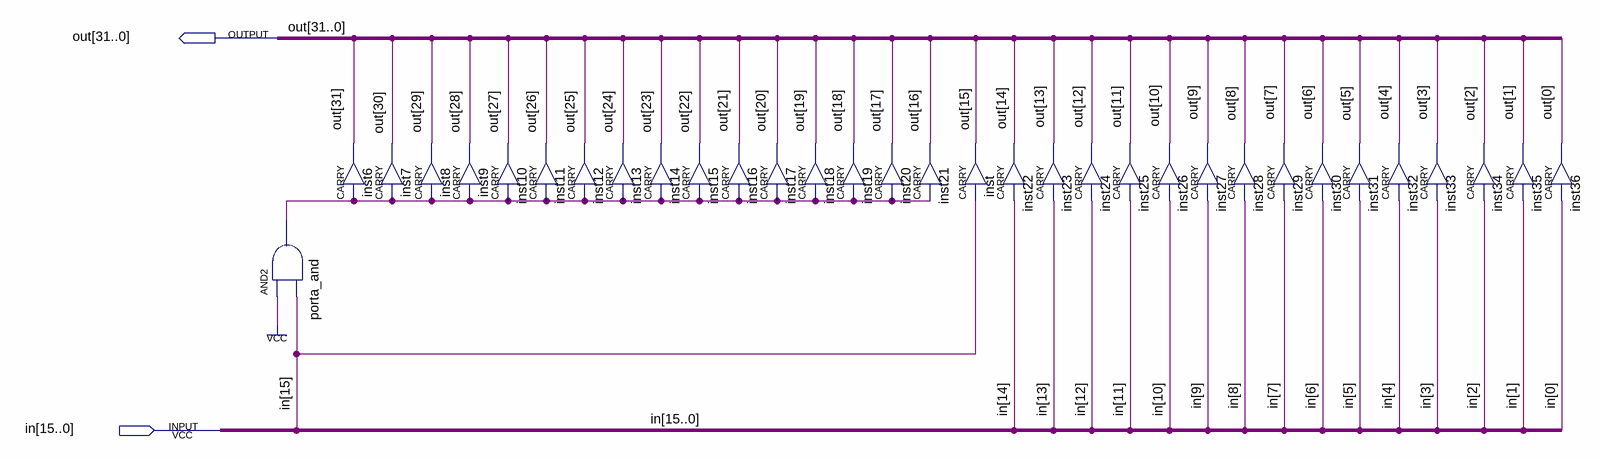
[diagram p0: schematic sheet]
// Quartus schematic extensao_sinal.bdf as structural Verilog: 33 symbols, 2 pins
module extensao_sinal (
  input  [15:0] in,
  output [31:0] out
);

  wire porta_and_out;

  and porta_and (porta_and_out, 1'b1, in[15]);
  CARRY inst6 (.IN(porta_and_out), .OUT(out[31]));
  CARRY inst7 (.IN(porta_and_out), .OUT(out[30]));
  CARRY inst8 (.IN(porta_and_out), .OUT(out[29]));
  CARRY inst9 (.IN(porta_and_out), .OUT(out[28]));
  CARRY inst10 (.IN(porta_and_out), .OUT(out[27]));
  CARRY inst11 (.IN(porta_and_out), .OUT(out[26]));
  CARRY inst12 (.IN(porta_and_out), .OUT(out[25]));
  CARRY inst13 (.IN(porta_and_out), .OUT(out[24]));
  CARRY inst14 (.IN(porta_and_out), .OUT(out[23]));
  CARRY inst15 (.IN(porta_and_out), .OUT(out[22]));
  CARRY inst16 (.IN(porta_and_out), .OUT(out[21]));
  CARRY inst17 (.IN(porta_and_out), .OUT(out[20]));
  CARRY inst18 (.IN(porta_and_out), .OUT(out[19]));
  CARRY inst19 (.IN(porta_and_out), .OUT(out[18]));
  CARRY inst20 (.IN(porta_and_out), .OUT(out[17]));
  CARRY inst21 (.IN(porta_and_out), .OUT(out[16]));
  CARRY inst (.IN(in[15]), .OUT(out[15]));
  CARRY inst22 (.IN(in[14]), .OUT(out[14]));
  CARRY inst23 (.IN(in[13]), .OUT(out[13]));
  CARRY inst24 (.IN(in[12]), .OUT(out[12]));
  CARRY inst25 (.IN(in[11]), .OUT(out[11]));
  CARRY inst26 (.IN(in[10]), .OUT(out[10]));
  CARRY inst27 (.IN(in[9]), .OUT(out[9]));
  CARRY inst28 (.IN(in[8]), .OUT(out[8]));
  CARRY inst29 (.IN(in[7]), .OUT(out[7]));
  CARRY inst30 (.IN(in[6]), .OUT(out[6]));
  CARRY inst31 (.IN(in[5]), .OUT(out[5]));
  CARRY inst32 (.IN(in[4]), .OUT(out[4]));
  CARRY inst33 (.IN(in[3]), .OUT(out[3]));
  CARRY inst34 (.IN(in[2]), .OUT(out[2]));
  CARRY inst35 (.IN(in[1]), .OUT(out[1]));
  CARRY inst36 (.IN(in[0]), .OUT(out[0]));
endmodule
